# EAGLE design Variometer (EAGLE 8.5.2)
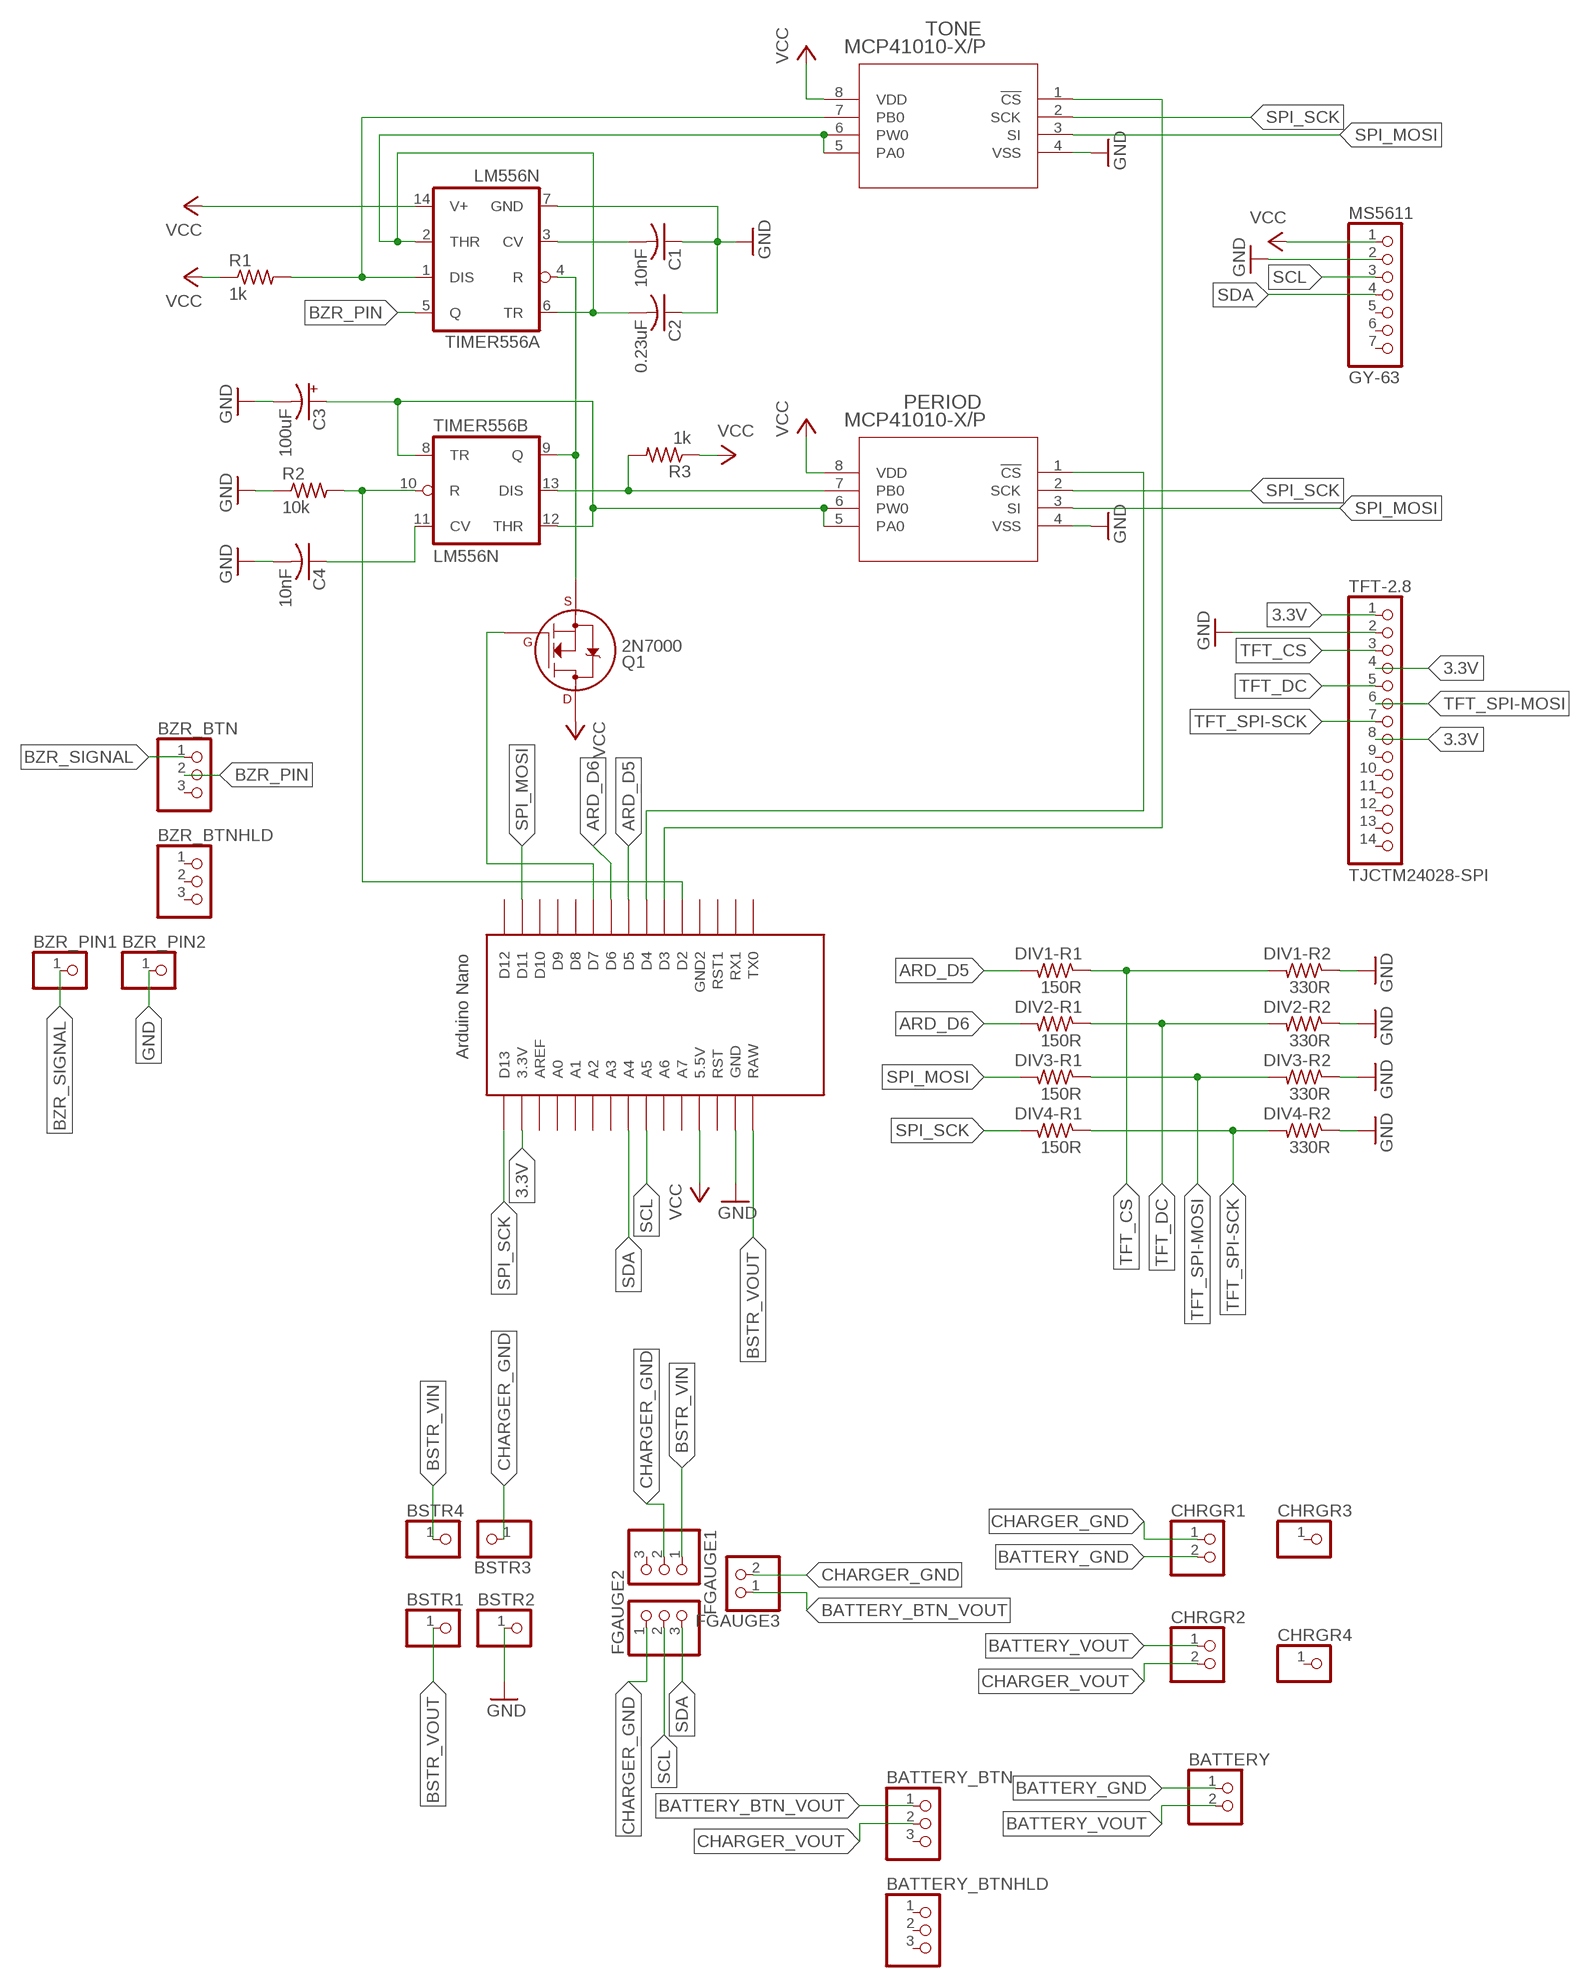
[diagram p0: schematic, sheet 1]

## Parts
BATTERY  PINHD-1X2  [1X02]
BATTERY_BTN  PINHD-1X3  [1X03]
BATTERY_BTNHLD  PINHD-1X3  [1X03]
BSTR1  PINHD-1X1  [1X01]
BSTR2  PINHD-1X1  [1X01]
BSTR3  PINHD-1X1  [1X01]
BSTR4  PINHD-1X1  [1X01]
BZR_BTN  PINHD-1X3  [1X03]
BZR_BTNHLD  PINHD-1X3  [1X03]
BZR_PIN1  PINHD-1X1  [1X01]
BZR_PIN2  PINHD-1X1  [1X01]
C1  10nF  C-US025-024X044  [C025-024X044]
C2  0.23uF  C-US050-025X075  [C050-025X075]
C3  100uF  CPOL-USE2.5-7  [E2,5-7]
C4  10nF  C-US025-024X044  [C025-024X044]
CHRGR1  PINHD-1X2  [1X02]
CHRGR2  PINHD-1X2  [1X02]
CHRGR3  PINHD-1X1  [1X01]
CHRGR4  PINHD-1X1  [1X01]
DIV1-R1  150R  R-US_R0805  [R0805]
DIV1-R2  330R  R-US_R0805  [R0805]
DIV2-R1  150R  R-US_R0805  [R0805]
DIV2-R2  330R  R-US_R0805  [R0805]
DIV3-R1  150R  R-US_R0805  [R0805]
DIV3-R2  330R  R-US_R0805  [R0805]
DIV4-R1  150R  R-US_R0805  [R0805]
DIV4-R2  330R  R-US_R0805  [R0805]
FGAUGE1  PINHD-1X3  [1X03]
FGAUGE2  PINHD-1X3  [1X03]
FGAUGE3  PINHD-1X2  [1X02]
MS5611  GY-63  PINHD-1X7  [1X07]
PERIOD  MCP41010-X/P  [PDIP8_300MC]
Q1  2N7000  2N7000_TO92  [TO-92]
R1  1k  R-US_R0805  [R0805]
R2  10k  R-US_R0805  [R0805]
R3  1k  R-US_R0805  [R0805]
TFT-2.8  TJCTM24028-SPI  PINHD-1X14  [1X14]
TIMER556  LM556N  [DIL14]
TONE  MCP41010-X/P  [PDIP8_300MC]
U$1  NANO  [NANO]

## Nets
3.3V: TFT-2.8.1 TFT-2.8.4 TFT-2.8.8 U$1.3.3V
ARD_D5: DIV1-R1.2 U$1.D5
ARD_D6: DIV2-R1.2 U$1.D6
BATTERY_BTN_VOUT: BATTERY_BTN.1 FGAUGE3.1
BATTERY_GND: BATTERY.1 CHRGR1.2
BATTERY_VOUT: BATTERY.2 CHRGR2.1
BSTR_VIN: BSTR4.1 FGAUGE1.1
BSTR_VOUT: BSTR1.1 U$1.RAW
BZR_PIN: BZR_BTN.2 TIMER556.5(A:Q)
BZR_SIGNAL: BZR_BTN.1 BZR_PIN1.1
CHARGER_GND: BSTR3.1 CHRGR1.1 FGAUGE1.2 FGAUGE2.1 FGAUGE3.2
CHARGER_VOUT: BATTERY_BTN.2 CHRGR2.2
GND: BSTR2.1 BZR_PIN2.1 C1.1 C2.1 C3.- C4.2 DIV1-R2.1 DIV2-R2.1 DIV3-R2.1 DIV4-R2.1 MS5611.2 PERIOD.4(VSS) R2.1 TFT-2.8.2 TIMER556.7(A:GND) TONE.4(VSS) U$1.GND
N$1: C2.2 TIMER556.2(A:THR) TIMER556.6(A:TR) TONE.5(PA0) TONE.6(PW0)
N$2: C1.2 TIMER556.3(A:CV)
N$4: Q1.1(S) TIMER556.4(A:R) TIMER556.9(B:Q)
N$5: Q1.2(G) U$1.D7
N$6: C4.1 TIMER556.11(B:CV)
N$7: TONE.1(!CS) U$1.D3
N$8: PERIOD.7(PB0) R3.2 TIMER556.13(B:DIS)
N$9: R2.2 TIMER556.10(B:R) U$1.D2
N$10: R1.2 TIMER556.1(A:DIS) TONE.7(PB0)
N$11: C3.+ PERIOD.5(PA0) PERIOD.6(PW0) TIMER556.8(B:TR) TIMER556.12(B:THR)
N$15: PERIOD.1(!CS) U$1.D4
SCL: FGAUGE2.2 MS5611.3 U$1.A5
SDA: FGAUGE2.3 MS5611.4 U$1.A4
SPI_MOSI: DIV3-R1.2 PERIOD.3(SI) TONE.3(SI) U$1.D11
SPI_SCK: DIV4-R1.2 PERIOD.2(SCK) TONE.2(SCK) U$1.D13
TFT_CS: DIV1-R1.1 DIV1-R2.2 TFT-2.8.3
TFT_DC: DIV2-R1.1 DIV2-R2.2 TFT-2.8.5
TFT_SPI-MOSI: DIV3-R1.1 DIV3-R2.2 TFT-2.8.6
TFT_SPI-SCK: DIV4-R1.1 DIV4-R2.2 TFT-2.8.7
VCC: MS5611.1 PERIOD.8(VDD) Q1.3(D) R1.1 R3.1 TIMER556.14(A:V+) TONE.8(VDD) U$1.5V(5.5V)
Unconnected: BATTERY_BTN.3 BATTERY_BTNHLD.1 BATTERY_BTNHLD.2 BATTERY_BTNHLD.3 BZR_BTN.3 BZR_BTNHLD.1 BZR_BTNHLD.2 BZR_BTNHLD.3 CHRGR3.1 CHRGR4.1 FGAUGE1.3 MS5611.5 MS5611.6 MS5611.7 TFT-2.8.9 TFT-2.8.10 TFT-2.8.11 TFT-2.8.12 TFT-2.8.13 TFT-2.8.14 U$1.A0 U$1.A1 U$1.A2 U$1.A3 U$1.A6 U$1.A7 U$1.AREF U$1.D8 U$1.D9 U$1.D10 U$1.D12 U$1.GND1(GND2) U$1.ICSP1 U$1.ICSP2 U$1.ICSP3 U$1.ICSP4 U$1.ICSP5 U$1.ICSP6 U$1.RST U$1.RST1 U$1.RX1 U$1.TX0

## Library data of the parts
BATTERY CHRGR1 CHRGR2 FGAUGE3 = pinhead:PINHD-1X2: PIN HEADER
BATTERY_BTN BATTERY_BTNHLD BZR_BTN BZR_BTNHLD FGAUGE1 FGAUGE2 = pinhead:PINHD-1X3: PIN HEADER
BSTR1-BSTR4 BZR_PIN1 BZR_PIN2 CHRGR3 CHRGR4 = pinhead:PINHD-1X1: PIN HEADER
C1 C2 C4 = resistor:C-US: CAPACITOR, American symbol
C3 = resistor:CPOL-US: POLARIZED CAPACITOR, American symbol
DIV1-R1 DIV1-R2 DIV2-R1 DIV2-R2 DIV3-R1 DIV3-R2 DIV4-R1 DIV4-R2 R1-R3 = adafruit:R-US_: RESISTOR, American symbol
MS5611 = pinhead:PINHD-1X7: PIN HEADER
PERIOD TONE = Potentiometer:MCP41010-X/P
Q1 = transistors:2N700*: 2N7000, 2N7002, NDS7002A N-channel enhancement mode MOSFET
TFT-2.8 = pinhead:PINHD-1X14: PIN HEADER
TIMER556 = linear:*556: Dual TIMER
U$1 = Arduino-clone:NANO: Arduino Nano

## Board
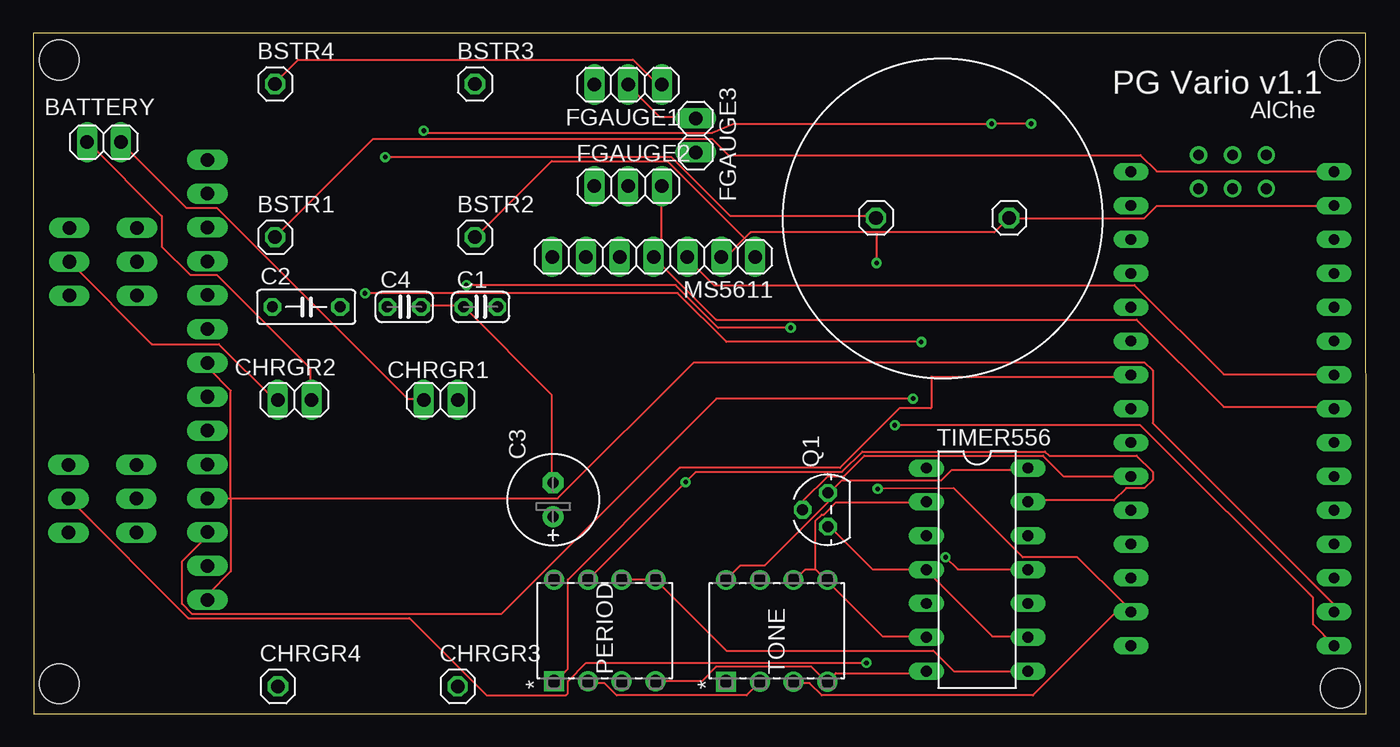
[diagram p1: board, top side]
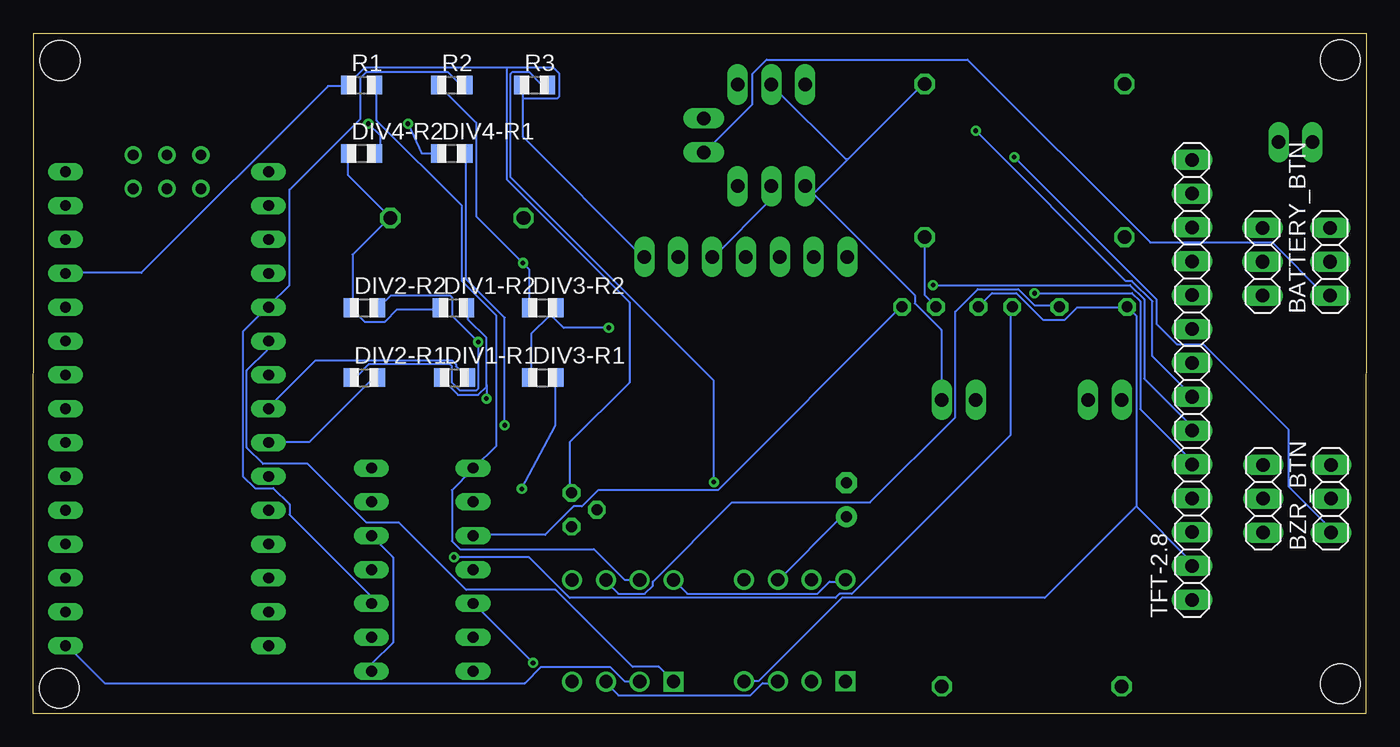
[diagram p2: board, bottom side, seen from below]

Size 100.05 x 51.05 mm. Coordinates in mm from the lower left corner, seen from the top.
Outline: 0.05,0 100.05,0 100,51.05 0,51.05 0.05,0
Copper layers (1*16): Top 0.035mm / dielectric 1.5mm / Bottom 0.035mm
Design rules "default": minimum track width 6mil, minimum drill 0.35mm, track to track 6mil, track to pad 6mil, pad to pad 6mil, via to via 6mil, smd to smd 6mil, copper to edge 40mil, drill to drill 6mil, minimum pad ring 10mil, minimum via ring 8mil, stop-mask expansion 4mil, vias tented up to drill 0mil, thermal gap 10mil
Holes 3 mm at 1.95,49.05 1.95,2.25 98.1,1.9 98.05,49

### Footprints (pad centres in the part's own frame; a part is rotated, then mirrored left to right if it is on the bottom)
1X02 = drill 1.016 long: 1 -1.27,0; 2 1.27,0
1X03 = drill 1.016 long: 1 -2.54,0; 2 0,0; 3 2.54,0
1X01 = drill 1.016 octagon: 1 0,0
C025-024X044 = drill 0.813 octagon: 1 -1.27,0; 2 1.27,0
C050-025X075 = drill 0.813 octagon: 1 -2.54,0; 2 2.54,0
E2,5-7 = drill 0.813 pad 1.6: + -1.27,0 | drill 0.813 pad 1.6 octagon: - 1.27,0
R0805 = smd 1.1 x 1.4: 1 -1,0; 2 1,0
1X07 = drill 1.016 long: 1 -7.62,0; 2 -5.08,0; 3 -2.54,0; 4 0,0; 5 2.54,0; 6 5.08,0; 7 7.62,0
PDIP8_300MC = drill 0.991 pad 1.499 square: 1 -7.62,7.62 | drill 0.991 pad 1.499: 2 -7.62,5.08; 3 -7.62,2.54; 4 -7.62,0; 5 0,0; 6 0,2.54; 7 0,5.08; 8 0,7.62
TO-92 = drill 0.813 octagon: 1 -1.27,0; 2 0,1.905; 3 1.27,0
1X14 = drill 1.016 long: 1 -16.51,0; 2 -13.97,0; 3 -11.43,0; 4 -8.89,0; 5 -6.35,0; 6 -3.81,0; 7 -1.27,0; 8 1.27,0; 9 3.81,0; 10 6.35,0; 11 8.89,0; 12 11.43,0; 13 13.97,0; 14 16.51,0
DIL14 = drill 0.813 long: 1 -7.62,-3.81; 2 -5.08,-3.81; 3 -2.54,-3.81; 4 0,-3.81; 5 2.54,-3.81; 6 5.08,-3.81; 7 7.62,-3.81; 8 7.62,3.81; 9 5.08,3.81; 10 2.54,3.81; 11 0,3.81; 12 -2.54,3.81; 13 -5.08,3.81; 14 -7.62,3.81
NANO = drill 0.8 long: 3.3V -10.16,24.13; 5V -10.16,-1.27; A0 -10.16,19.05; A1 -10.16,16.51; A2 -10.16,13.97; A3 -10.16,11.43; A4 -10.16,8.89; A5 -10.16,6.35; A6 -10.16,3.81; A7 -10.16,1.27; AREF -10.16,21.59; D2 5.08,1.27; D3 5.08,3.81; D4 5.08,6.35; D5 5.08,8.89; D6 5.08,11.43; D7 5.08,13.97; D8 5.08,16.51; D9 5.08,19.05; D10 5.08,21.59; D11 5.08,24.13; D12 5.08,26.67; D13 -10.16,26.67; GND -10.16,-6.35; GND1 5.08,-1.27; RAW -10.16,-8.89; RST -10.16,-3.81; RST1 5.08,-3.81; RX1 5.08,-6.35; TX0 5.08,-8.89 | drill 0.8: ICSP1 -5.08,-10.16; ICSP2 -5.08,-7.62; ICSP3 -2.54,-10.16; ICSP4 -2.54,-7.62; ICSP5 0,-10.16; ICSP6 0,-7.62

### Placement (x,y rotation side)
BATTERY  5.3,42.88 180 top
BATTERY_BTN  2.7,33.91 90 bottom
BATTERY_BTNHLD  7.78,33.91 90 bottom
BSTR1  18.15,35.75 0 top
BSTR2  33.15,35.75 0 top
BSTR3  33.15,47.25 0 top
BSTR4  18.15,47.25 0 top
BZR_BTN  2.65,16.13 90 bottom
BZR_BTNHLD  7.73,16.13 90 bottom
BZR_PIN1  63.25,37.2 0 top
BZR_PIN2  73.25,37.2 0 top
C1  33.57,30.52 0 top
C2  20.49,30.52 0 top
C3  39.02,16.05 90 top
C4  27.84,30.52 0 top
CHRGR1  30.58,23.55 180 top
CHRGR2  19.62,23.55 180 top
CHRGR3  31.85,2.05 0 top
CHRGR4  18.35,2.05 0 top
DIV1-R1  68.43,25.22 0 bottom
DIV1-R2  68.51,30.45 0 bottom
DIV2-R1  75.21,25.22 0 bottom
DIV2-R2  75.21,30.45 0 bottom
DIV3-R1  61.81,25.22 0 bottom
DIV3-R2  61.81,30.45 0 bottom
DIV4-R1  68.63,42.04 0 bottom
DIV4-R2  75.41,42.04 0 bottom
FGAUGE1  44.65,47.2 180 top
FGAUGE2  44.65,39.58 0 top
FGAUGE3  49.72,43.39 90 top
MS5611  46.56,34.28 180 top
PERIOD  46.71,10.04 90 top
Q1  59.65,15.3 90 top
R1  75.41,47.17 0 bottom
R2  68.63,47.17 0 bottom
R3  62.43,47.17 0 bottom
TFT-2.8  13.07,25.05 90 bottom
TIMER556  70.85,10.81 270 top
TONE  59.61,10.03 90 top
U$1  87.47,31.77 180 top

### Tracks (layer width: path | path; a pad name or v marks a point on that pad's centre or on a via)
3.3V
  Top 0.152: 14.83,16.15 13.16,16.15 TFT-2.8.4 | 14.83,16.15 39.37,16.15 49.58,26.36 83.41,26.36 84.02,25.76 84.02,21.79 97.59,8.23 97.59,7.77 U$1.3.3V | 14.83,16.15 14.83,10.67 13.16,8.99 13.16,8.69 TFT-2.8.1 | 14.83,16.15 14.83,24.23 13.16,25.91 13.16,26.21 TFT-2.8.8
ARD_D5
  Bottom 0.152: DIV1-R1.2 67.56,25.3 68.33,26.06 68.33,26.21 68.63,26.52 78.84,26.52 82.35,23.01 U$1.D5
ARD_D6
  Bottom 0.152: DIV2-R1.2 74.27,25.15 74.57,25.15 79.3,20.42 82.35,20.42 U$1.D6
BATTERY_BTN_VOUT
  Bottom 0.152: BATTERY_BTN.1 2.79,31.39 3.1,31.39 7.06,35.36 16.2,35.36 29.92,49.07 45.01,49.07 46.07,48.01 46.07,45.72 49.58,42.22 FGAUGE3.1
BATTERY_GND
  Top 0.152: CHRGR1.2 29.16,23.62 28.09,23.62 13.77,37.95 11.48,37.95 6.6,42.82 BATTERY.1
BATTERY_VOUT
  Top 0.152: CHRGR2.1 20.78,23.62 20.78,25.91 13.77,32.92 11.79,32.92 9.65,35.05 9.65,37.34 4.17,42.82 BATTERY.2
BSTR_VIN
  Top 0.152: FGAUGE1.1 47.14,47.24 46.84,47.24 45.01,49.07 19.86,49.07 18.19,47.4 BSTR4.1
BSTR_VOUT
  Top 0.152: U$1.RAW 97.59,40.69 84.33,40.69 83.11,41.91 52.17,41.91 50.95,43.13 25.5,43.13 18.19,35.81 BSTR1.1
BZR_PIN  (via drill 0.35)
  Top 0.152: v62.53,3.81 41.5,3.81 40.13,2.44 40.13,1.52 39.98,1.37 34.03,1.37 28.24,7.16 11.63,7.16 2.79,16 BZR_BTN.2
  Bottom 0.152: v62.53,3.81 66.95,8.23 TIMER556.5
BZR_SIGNAL  (via drill 0.35)
  Top 0.152: v26.41,41.76 47.9,41.76 52.32,37.34 63.14,37.34 BZR_PIN1.1
  Bottom 0.152: v26.41,41.76 15.75,31.09 15.75,29.26 14.22,27.74 12.24,27.74 5.84,21.34 5.84,17.07 2.79,14.02 2.79,13.72 BZR_BTN.1
CHARGER_GND
  Top 0.152: FGAUGE3.2 49.58,44.81 46.99,44.81 44.7,47.09 FGAUGE1.2
  Bottom 0.152: 41.5,39.01 41.96,39.47 FGAUGE2.1 41.5,39.01 | 41.5,39.01 33.88,31.39 33.88,30.79 31.9,28.8 31.9,23.62 CHRGR1.1 | 41.5,39.01 38.91,41.6 | 38.91,41.6 33.27,47.24 BSTR3.1 | 38.91,41.6 39.06,41.6 44.55,47.09 FGAUGE1.2
CHARGER_VOUT
  Top 0.152: CHRGR2.2 18.34,23.62 18.03,23.62 13.92,27.74 8.89,27.74 2.79,33.83 BATTERY_BTN.2
GND  (via drill 0.35)
  Top 0.152: U$1.GND 97.59,38.1 84.33,38.1 83.41,37.19 73.35,37.19 BZR_PIN2.1 73.2,37.19 72.13,36.12 63.3,36.12 | 53.39,35.66 53.85,36.12 63.3,36.12 | 53.39,35.66 52.02,34.29 51.71,34.29 MS5611.2 | 63.3,36.12 v63.3,33.81 | TIMER556.7 66.95,3.05 60.25,3.05 TONE.4 59.49,2.44 58.42,3.5 51.26,3.5 50.19,2.44 46.84,2.44 PERIOD.4 | C4.2 29.16,30.63 32.21,30.63 C1.1 32.36,30.48 38.91,23.93 38.91,17.37 C3.- | 53.39,35.66 47.6,41.45 38.91,41.45 33.27,35.81 BSTR2.1
  Bottom 0.152: DIV3-R2.1 62.84,30.48 62.84,33.36 v63.3,33.81 66.8,37.32 66.8,44.35 69.54,47.09 R2.1 | DIV1-R2.1 69.54,30.33 72.74,30.33 73.66,29.41 75.18,29.41 76.1,30.33 DIV2-R2.1 76.1,30.48 76.1,34.44 73.35,37.19 BZR_PIN2.1 73.35,37.34 76.4,40.39 76.4,41.91 DIV4-R2.1 | C4.2 29.01,30.63 28.09,31.55 26.26,31.55 24.28,29.57 22.61,29.57 21.69,30.48 18.03,30.48 C2.1 17.88,30.48 17.27,29.87 17.27,15.54 | 17.27,15.54 13.16,11.43 13.16,11.12 TFT-2.8.2 | BSTR2.1 33.12,35.66 33.12,31.39 32.36,30.63 C1.1 | 17.27,15.54 24.13,8.69 39.37,8.69 45.62,2.44 46.68,2.44 PERIOD.4
N$1
  Top 0.152: TIMER556.6 66.95,5.79 63.75,5.79 59.64,9.91 TONE.5 59.49,10.06 58.72,10.82 | 58.72,10.82 58.72,14.48 59.18,14.94 59.33,14.94 60.25,15.85 66.95,15.85 TIMER556.2 | 58.72,10.82 57.96,10.82 57.2,10.06 TONE.6
  Bottom 0.152: C2.2 23.06,30.63 24.89,30.63 26.11,31.85 29.16,31.85 30.84,30.18 30.84,22.25 37.24,15.85 47.6,15.85 53.54,9.91 53.54,9.6 54.15,8.99 56.13,8.99 57.05,9.91 TONE.6
N$2
  Bottom 0.152: TIMER556.3 66.95,13.41 61.62,13.41 59.49,15.54 58.88,15.54 57.66,16.76 48.67,16.76 34.95,30.48 C1.2
N$4
  Top 0.152: Q1.1 59.79,14.02 62.99,10.82 66.95,10.82 TIMER556.4 67.11,10.67 71.98,5.79 74.57,5.79 TIMER556.9
N$5
  Top 0.152: U$1.D7 82.35,17.83 77.32,17.83 75.79,19.36 62.38,19.36 60.86,17.83 59.64,17.83 57.81,16 57.81,15.39 Q1.2
N$6  (via drill 0.35)
  Top 0.152: v68.48,11.73 69.39,10.82 74.57,10.82 TIMER556.11
  Bottom 0.152: v68.48,11.73 62.84,11.73 59.79,8.69 39.83,8.69 39.52,8.99 38.61,8.99 26.72,20.88 26.72,30.48 C4.1
N$7
  Bottom 0.152: TONE.1 53.08,3.5 55.07,3.5 60.86,9.3 67.56,9.3 72.59,14.33 75.03,14.33 79.45,18.75 82.8,18.75 84.02,19.96 84.02,25.76 82.5,27.28 82.5,27.89 U$1.D3
N$8  (via drill 0.35)
  Top 0.152: PERIOD.7 41.65,10.06 v48.97,17.37 49.73,18.14 60.7,18.14 62.23,19.66 75.94,19.66 76.25,19.36 82.8,19.36 84.02,18.14 84.02,17.53 83.41,16.92 82.04,16.92 81.13,16 74.73,16 TIMER556.13
  Bottom 0.152: v48.97,17.37 48.97,24.99 64.21,40.23 64.21,48.01 64.06,48.16 62.84,48.16 61.92,47.24 61.47,47.24 R3.2
N$9
  Bottom 0.152: R2.2 67.72,47.24 68.02,47.24 68.94,48.16 75.03,48.16 75.49,47.7 75.49,44.65 80.82,39.32 80.82,32.16 82.35,30.63 U$1.D2 82.5,30.48 84.33,28.65 84.33,17.83 83.41,16.92 82.04,16.92 80.82,15.7 80.82,14.94 74.73,8.84 74.73,8.38 TIMER556.10
N$10
  Bottom 0.152: R1.2 74.27,47.09 74.27,44.5 67.87,38.1 67.87,32.46 65.28,29.87 65.28,20.12 66.95,18.44 TIMER556.1 67.11,18.29 68.63,16.76 68.63,12.95 68.02,12.34 57.96,12.34 55.68,10.06 54.61,10.06 TONE.7
N$11
  Top 0.152: PERIOD.6 44.25,10.06 46.68,10.06 PERIOD.5 46.84,9.91 52.02,4.72 67.56,4.72 69.09,3.2 74.57,3.2 TIMER556.8
  Bottom 0.152: TIMER556.8 74.57,3.2 74.57,3.81 73.05,5.33 73.05,11.73 74.57,13.26 TIMER556.12 | C3.+ 39.06,14.63 39.52,14.63 44.09,10.06 PERIOD.6
N$15
  Top 0.152: U$1.D4 82.35,25.3 67.41,25.3 67.41,22.96 67.35,22.9 65.01,22.9 60.55,18.44 48.51,18.44 40.13,10.06 40.13,3.35 39.22,2.44 PERIOD.1
SCL
  Top 0.152: U$1.A5 97.59,25.45 89.36,25.45 82.65,32.16 51.1,32.16 49.12,34.14 MS5611.3
  Bottom 0.152: FGAUGE2.2 44.7,39.47 44.7,38.56 48.97,34.29 MS5611.3
SDA
  Top 0.152: U$1.A4 97.59,23.01 89.36,23.01 82.8,29.57 51.26,29.57 46.68,34.14 MS5611.4 46.68,34.29 47.14,34.75 47.14,39.47 FGAUGE2.3
SPI_MOSI  (via drill 0.35)
  Top 0.152: v63.38,16.87 69.09,16.92 74.27,11.73 78.38,11.73 81.89,8.23 | 81.89,8.23 82.35,7.77 U$1.D11 81.89,8.23 | 81.89,8.23 75.03,1.37 59.18,1.37 58.27,2.29 57.2,2.29 TONE.3
  Bottom 0.152: PERIOD.3 44.25,2.29 45.31,2.29 46.23,1.37 56.13,1.37 57.05,2.29 TONE.3 | v63.38,16.87 60.86,21.64 60.86,25.15 DIV3-R1.2
SPI_SCK  (via drill 0.35)
  Top 0.152: PERIOD.2 41.65,2.29 42.87,2.29 43.79,1.37 53.54,1.37 54.46,2.29 TONE.2 | v64.67,21.64 83.11,21.64 96.06,8.69 96.06,6.71 97.59,5.18 U$1.D13
  Bottom 0.152: v64.67,21.64 64.67,29.72 67.56,32.61 67.56,41.91 DIV4-R1.2 | TONE.2 54.61,2.44 55.68,2.44 56.74,3.5 61.92,3.5 63.14,2.29 94.69,2.29 97.59,5.18 U$1.D13
TFT_CS  (via drill 0.35)
  Top 0.152: TFT-2.8.3 13,13.56 13,13.26 11.18,11.43 11.18,8.23 11.94,7.47 35.1,7.47 51.27,23.64 v66.04,23.64
  Bottom 0.152: 66.04,24.69 66.04,24.54 66.65,23.93 68.17,23.93 69.39,25.15 DIV1-R1.1 | 66.04,24.69 66.04,28.19 67.41,29.57 67.41,30.33 DIV1-R2.2 | 66.04,24.69 v66.04,23.64
TFT_DC  (via drill 0.35)
  Top 0.152: v24.89,31.55 48.36,31.55 52.02,27.89 v66.65,27.89
  Bottom 0.152: DIV2-R1.1 76.1,25.3 75.79,25.3 74.88,26.21 68.78,26.21 68.63,26.06 68.63,24.84 68.02,24.23 66.8,24.23 66.65,24.38 v66.65,27.89 68.63,29.87 68.63,31.24 68.78,31.39 73.2,31.39 74.12,30.48 DIV2-R2.2 | v24.89,31.55 17.58,31.55 16.97,30.94 16.97,22.86 13.16,19.05 13.16,18.75 TFT-2.8.5
TFT_SPI-MOSI  (via drill 0.35)
  Top 0.152: v32.51,32.16 48.21,32.16 51.41,28.96 v56.85,28.96
  Bottom 0.152: 61.31,29.87 60.86,30.33 DIV3-R2.2 61.31,29.87 | 61.31,29.87 62.69,28.5 62.69,25.3 DIV3-R1.1 | v32.51,32.16 17.73,32.16 16.66,31.09 16.66,25.15 13.16,21.64 13.16,21.34 TFT-2.8.6 | 61.31,29.87 61.11,29.83 60.24,28.96 v56.85,28.96
TFT_SPI-SCK  (via drill 0.35)
  Top 0.152: v74.9,44.27 v71.92,44.27 52.57,44.27 50.95,43.59 29.46,43.59 v29.31,43.74
  Bottom 0.152: DIV4-R1.1 69.7,42.06 70.92,42.06 v71.92,44.27 | DIV4-R2.2 74.27,42.06 74.02,42.32 74.02,43.38 v74.9,44.27 | v29.31,43.74 18.03,32.46 17.58,32.46 16.05,30.94 16.05,26.82 13.16,23.93 TFT-2.8.7
VCC
  Top 0.152: TONE.8 53.08,11.12 54.91,11.12 59.64,15.85 59.64,16.46 Q1.3 59.79,16.61 60.7,17.53 68.17,17.53 68.94,18.29 74.57,18.29 TIMER556.14
  Bottom 0.152: TONE.8 50.95,8.99 41.2,8.99 40.28,9.91 39.22,9.91 PERIOD.8 | 63.3,46.18 63.3,43.28 54.3,34.29 MS5611.1 | 63.3,46.18 63.3,47.09 R3.1 | 64.52,48.46 61.01,48.46 60.55,48.01 60.55,46.33 60.7,46.18 63.3,46.18 | 64.52,48.46 75.18,48.46 76.4,47.24 R1.1 76.55,47.09 77.93,47.09 91.95,33.07 97.59,33.07 U$1.5V | 64.52,48.46 64.52,40.08 55.3,30.87 55.3,24.84 59.79,20.35 59.79,16.61 Q1.3

### Text on the board
tPlace: PG Vario v1.1 | AlChe